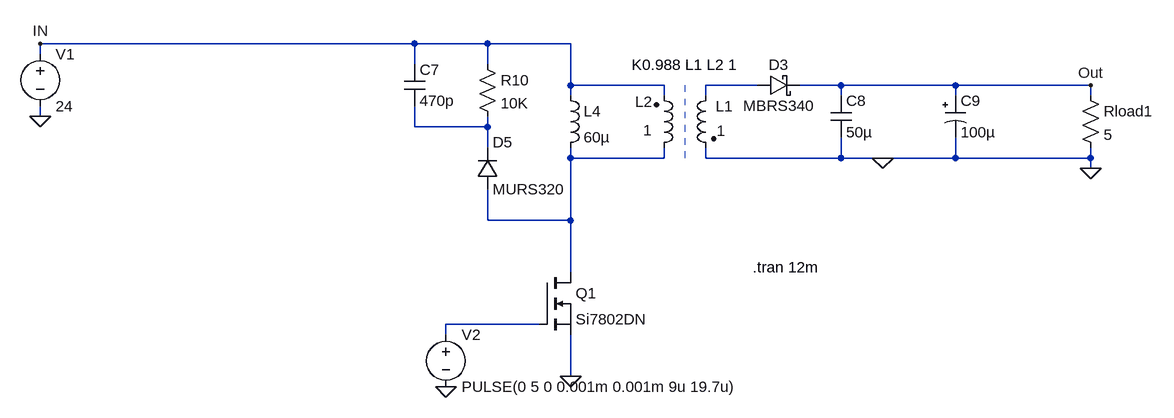
[diagram p0: schematic openloop.asc]
openloop.asc, the LTspice schematic file:
Version 4
SHEET 1 1032 680
WIRE -112 -256 -688 -256
WIRE 0 -256 -112 -256
WIRE 128 -256 0 -256
WIRE -688 -240 -688 -256
WIRE -112 -224 -112 -256
WIRE 0 -224 0 -256
WIRE 128 -192 128 -256
WIRE 272 -192 128 -192
WIRE 416 -192 336 -192
WIRE 544 -192 480 -192
WIRE 720 -192 544 -192
WIRE 928 -192 720 -192
WIRE 128 -176 128 -192
WIRE 272 -176 272 -192
WIRE 336 -176 336 -192
WIRE 544 -176 544 -192
WIRE 720 -176 720 -192
WIRE 928 -176 928 -192
WIRE -688 -144 -688 -160
WIRE -112 -128 -112 -160
WIRE 0 -128 0 -144
WIRE 0 -128 -112 -128
WIRE 0 -96 0 -128
WIRE 128 -80 128 -96
WIRE 272 -80 272 -96
WIRE 272 -80 128 -80
WIRE 336 -80 336 -96
WIRE 544 -80 544 -112
WIRE 544 -80 336 -80
WIRE 608 -80 544 -80
WIRE 720 -80 720 -112
WIRE 720 -80 608 -80
WIRE 928 -80 928 -96
WIRE 928 -80 720 -80
WIRE 928 -64 928 -80
WIRE 0 16 0 -32
WIRE 128 16 128 -80
WIRE 128 16 0 16
WIRE 128 96 128 16
WIRE 80 176 -64 176
WIRE -64 192 -64 176
WIRE 128 256 128 192
FLAG -688 -144 0
FLAG 928 -192 Out
FLAG 928 -64 0
FLAG -688 -256 IN
FLAG 608 -80 0
FLAG 128 256 0
FLAG -64 272 0
SYMBOL res -16 -240 R0
SYMATTR InstName R10
SYMATTR Value 10K
SYMBOL cap -128 -224 R0
SYMATTR InstName C7
SYMATTR Value 470p
SYMBOL ind2 352 -192 M0
WINDOW 0 1 32 Right 2
WINDOW 3 -1 70 Right 2
SYMATTR InstName L1
SYMATTR Value 1
SYMATTR SpiceLine Rser=.05 Rpar=2K
SYMBOL ind2 256 -80 M180
WINDOW 0 -2 87 Right 2
WINDOW 3 -3 43 Right 2
SYMATTR InstName L2
SYMATTR Value 1
SYMATTR SpiceLine Rser=.05 Rpar=5K
SYMBOL schottky 416 -208 M90
WINDOW 0 0 32 VBottom 2
WINDOW 3 32 32 VTop 2
SYMATTR InstName D3
SYMATTR Value MBRS340
SYMBOL cap 528 -176 R0
SYMATTR InstName C8
SYMATTR Value 50µ
SYMATTR SpiceLine Rser=.1
SYMBOL polcap 704 -176 R0
SYMATTR InstName C9
SYMATTR Value 100µ
SYMATTR SpiceLine Rser=.1
SYMBOL VOLTAGE -688 -256 R0
WINDOW 123 0 0 Left 0
WINDOW 39 0 0 Left 0
SYMATTR InstName V1
SYMATTR Value 24
SYMBOL diode -16 -32 M180
WINDOW 0 24 72 Left 2
WINDOW 3 24 0 Left 2
SYMATTR InstName D5
SYMATTR Value MURS320
SYMBOL res 912 -192 R0
SYMATTR InstName Rload1
SYMATTR Value 5
SYMBOL ind 112 -192 R0
SYMATTR InstName L4
SYMATTR Value 60µ
SYMBOL NMOS 80 96 R0
SYMATTR InstName Q1
SYMATTR Value Si7802DN
SYMBOL VOLTAGE -64 176 R0
WINDOW 123 0 0 Left 0
WINDOW 39 0 0 Left 0
SYMATTR InstName V2
SYMATTR Value PULSE(0 5 0 0.001m 0.001m 9u 19.7u)
TEXT 408 88 Left 2 !.tran 12m
TEXT 304 -208 Bottom 2 !K0.988 L1 L2 1
LINE Normal 304 -80 304 -192 2

The netlist it stands for:
* openloop.asc
R10 IN N002 10K
C7 IN N002 470p
L1 N001 0 1 Rser=.05 Rpar=2K
L2 N003 IN 1 Rser=.05 Rpar=5K
D3 N001 Out MBRS340
C8 Out 0 50µ Rser=.1
C9 Out 0 100µ Rser=.1
V1 IN 0 24
D5 N003 N002 MURS320
Rload1 Out 0 5
L4 IN N003 60µ
M§Q1 N003 N004 0 0 Si7802DN
V2 N004 0 PULSE(0 5 0 0.001m 0.001m 9u 19.7u)
.model D D
.lib standard.dio
.model NMOS NMOS
.model PMOS PMOS
.lib standard.mos
.tran 12m
K0.988 L1 L2 1
.backanno
.end